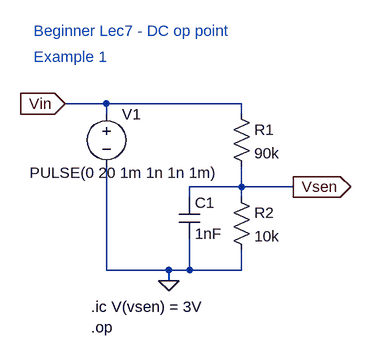
[diagram p0: schematic LTspice 03-1 DC op point example1.asc]
LTspice 03-1 DC op point example1.asc, the LTspice schematic file:
Version 4
SHEET 1 1576 680
WIRE 400 192 336 192
WIRE 608 192 400 192
WIRE 400 208 400 192
WIRE 608 208 608 192
WIRE 608 320 608 288
WIRE 608 320 528 320
WIRE 688 320 608 320
WIRE 528 336 528 320
WIRE 608 336 608 320
WIRE 400 448 400 288
WIRE 496 448 400 448
WIRE 528 448 528 400
WIRE 528 448 496 448
WIRE 608 448 608 416
WIRE 608 448 528 448
WIRE 496 464 496 448
FLAG 496 464 0
FLAG 688 320 Vsen
IOPIN 688 320 Out
FLAG 336 192 Vin
IOPIN 336 192 In
SYMBOL voltage 400 192 R0
WINDOW 123 0 0 Left 2
WINDOW 39 0 0 Left 2
WINDOW 3 -118 106 Left 2
SYMATTR Value PULSE(0 20 1m 1n 1n 1m)
SYMATTR InstName V1
SYMBOL res 592 192 R0
SYMATTR InstName R1
SYMATTR Value 90k
SYMBOL res 592 320 R0
SYMATTR InstName R2
SYMATTR Value 10k
SYMBOL cap 512 336 R0
SYMATTR InstName C1
SYMATTR Value 1nF
TEXT 288 80 Left 2 ;Beginner Lec7 - DC op point
TEXT 376 504 Left 2 !.ic V(vsen) = 3V
TEXT 376 536 Left 2 !.op
TEXT 288 120 Left 2 ;Example 1

The netlist it stands for:
* LTspice 03-1 DC op point example1.asc
V1 Vin 0 PULSE(0 20 1m 1n 1n 1m)
R1 Vin Vsen 90k
R2 Vsen 0 10k
C1 Vsen 0 1nF
* Beginner Lec7 - DC op point
.ic V(vsen) = 3V
.op
* Example 1
.backanno
.end